# Altium schematic sheet Spannungsteiler_high.SchDoc
size A4; CompanyName: Technische Hochschule Nürnberg Georg Simon Ohm; Address1: Fürther Straße 250; Address2: 90429 Nürnberg; Address3: GERMANY; SheetNumber: 4; SheetTotal: 6; CompanyName2: Institut ELSYS
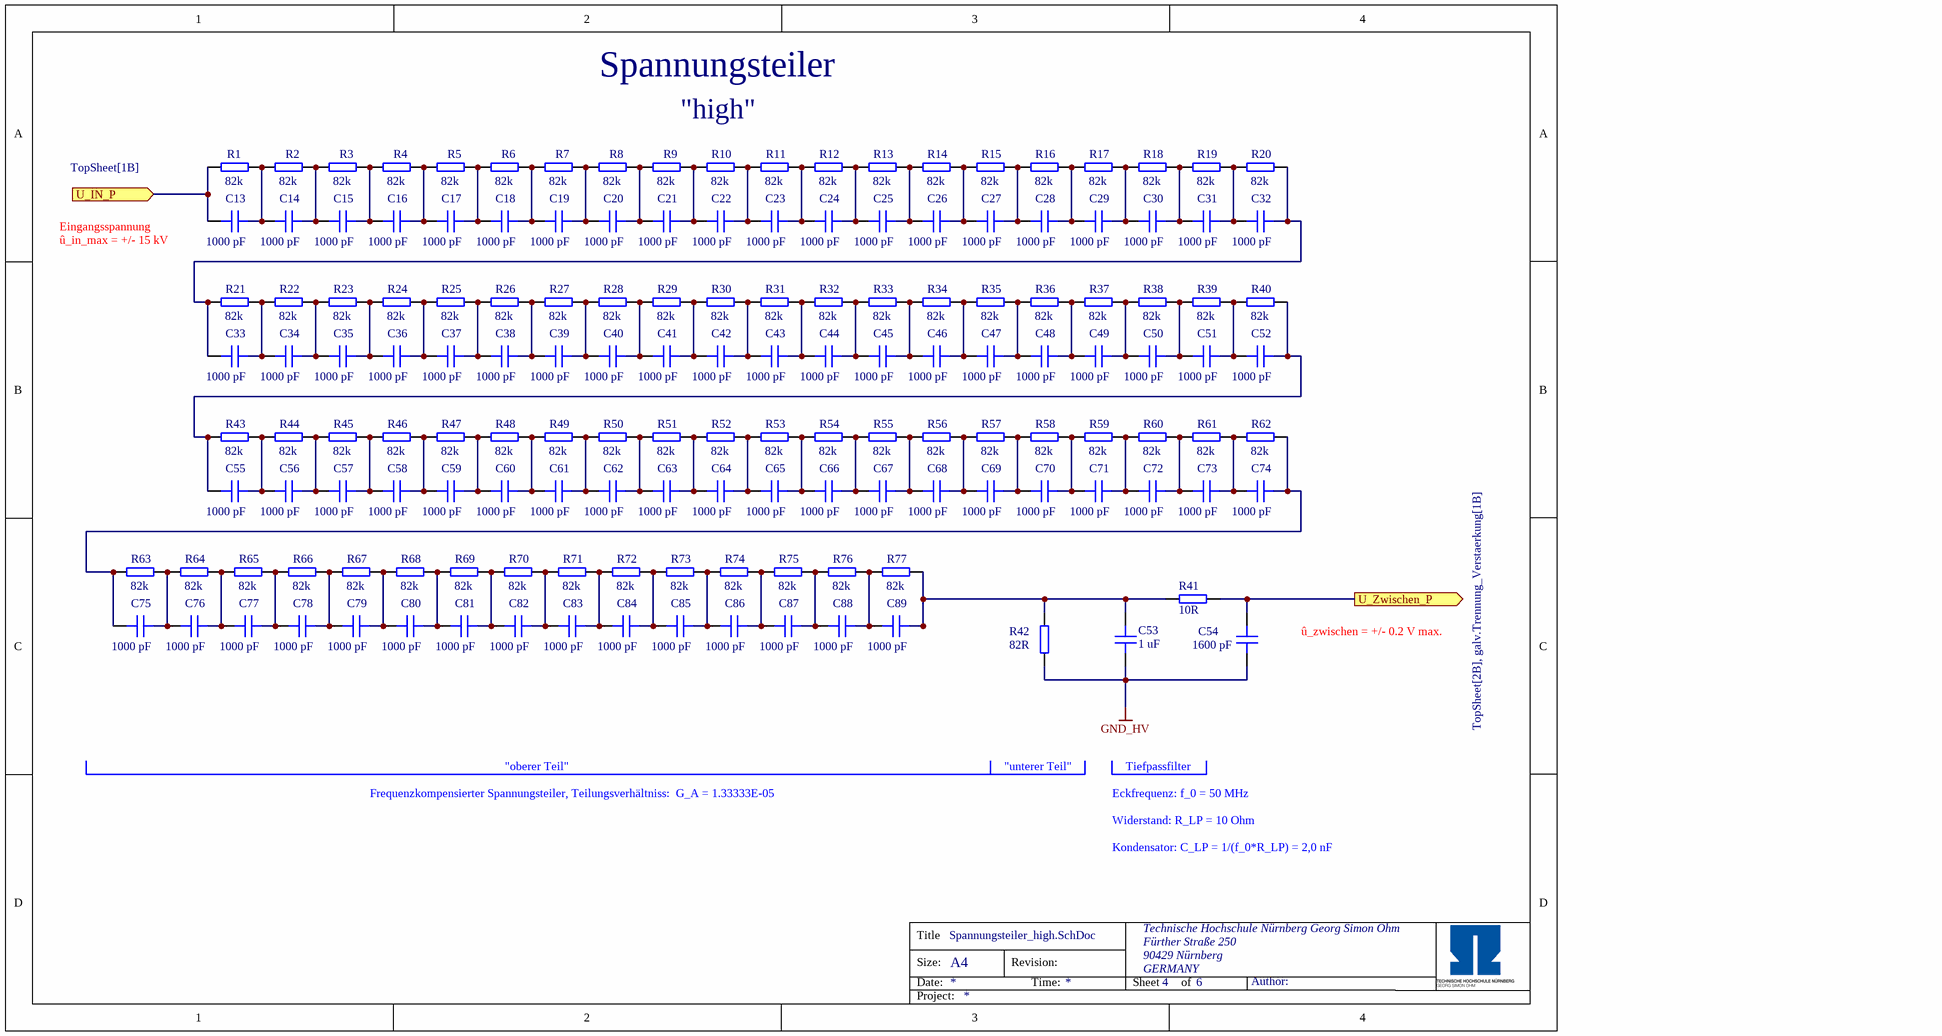
[diagram p0: Spannungsteiler_high.SchDoc]

## Parts
C13  1000 pF  [C_1206]
C14  1000 pF  [C_1206]
C15  1000 pF  [C_1206]
C16  1000 pF  [C_1206]
C17  1000 pF  [C_1206]
C18  1000 pF  [C_1206]
C19  1000 pF  [C_1206]
C20  1000 pF  [C_1206]
C21  1000 pF  [C_1206]
C22  1000 pF  [C_1206]
C23  1000 pF  [C_1206]
C24  1000 pF  [C_1206]
C25  1000 pF  [C_1206]
C26  1000 pF  [C_1206]
C27  1000 pF  [C_1206]
C28  1000 pF  [C_1206]
C29  1000 pF  [C_1206]
C30  1000 pF  [C_1206]
C31  1000 pF  [C_1206]
C32  1000 pF  [C_1206]
C33  1000 pF  [C_1206]
C34  1000 pF  [C_1206]
C35  1000 pF  [C_1206]
C36  1000 pF  [C_1206]
C37  1000 pF  [C_1206]
C38  1000 pF  [C_1206]
C39  1000 pF  [C_1206]
C40  1000 pF  [C_1206]
C41  1000 pF  [C_1206]
C42  1000 pF  [C_1206]
C43  1000 pF  [C_1206]
C44  1000 pF  [C_1206]
C45  1000 pF  [C_1206]
C46  1000 pF  [C_1206]
C47  1000 pF  [C_1206]
C48  1000 pF  [C_1206]
C49  1000 pF  [C_1206]
C50  1000 pF  [C_1206]
C51  1000 pF  [C_1206]
C52  1000 pF  [C_1206]
C53  1 uF  [C_1206]
C54  1600 pF  [C_1206]
C55  1000 pF  [C_1206]
C56  1000 pF  [C_1206]
C57  1000 pF  [C_1206]
C58  1000 pF  [C_1206]
C59  1000 pF  [C_1206]
C60  1000 pF  [C_1206]
C61  1000 pF  [C_1206]
C62  1000 pF  [C_1206]
C63  1000 pF  [C_1206]
C64  1000 pF  [C_1206]
C65  1000 pF  [C_1206]
C66  1000 pF  [C_1206]
C67  1000 pF  [C_1206]
C68  1000 pF  [C_1206]
C69  1000 pF  [C_1206]
C70  1000 pF  [C_1206]
C71  1000 pF  [C_1206]
C72  1000 pF  [C_1206]
C73  1000 pF  [C_1206]
C74  1000 pF  [C_1206]
C75  1000 pF  [C_1206]
C76  1000 pF  [C_1206]
C77  1000 pF  [C_1206]
C78  1000 pF  [C_1206]
C79  1000 pF  [C_1206]
C80  1000 pF  [C_1206]
C81  1000 pF  [C_1206]
C82  1000 pF  [C_1206]
C83  1000 pF  [C_1206]
C84  1000 pF  [C_1206]
C85  1000 pF  [C_1206]
C86  1000 pF  [C_1206]
C87  1000 pF  [C_1206]
C88  1000 pF  [C_1206]
C89  1000 pF  [C_1206]
R1  82k  [RES 1206_3216]
R2  82k  [RES 1206_3216]
R3  82k  [RES 1206_3216]
R4  82k  [RES 1206_3216]
R5  82k  [RES 1206_3216]
R6  82k  [RES 1206_3216]
R7  82k  [RES 1206_3216]
R8  82k  [RES 1206_3216]
R9  82k  [RES 1206_3216]
R10  82k  [RES 1206_3216]
R11  82k  [RES 1206_3216]
R12  82k  [RES 1206_3216]
R13  82k  [RES 1206_3216]
R14  82k  [RES 1206_3216]
R15  82k  [RES 1206_3216]
R16  82k  [RES 1206_3216]
R17  82k  [RES 1206_3216]
R18  82k  [RES 1206_3216]
R19  82k  [RES 1206_3216]
R20  82k  [RES 1206_3216]
R21  82k  [RES 1206_3216]
R22  82k  [RES 1206_3216]
R23  82k  [RES 1206_3216]
R24  82k  [RES 1206_3216]
R25  82k  [RES 1206_3216]
R26  82k  [RES 1206_3216]
R27  82k  [RES 1206_3216]
R28  82k  [RES 1206_3216]
R29  82k  [RES 1206_3216]
R30  82k  [RES 1206_3216]
R31  82k  [RES 1206_3216]
R32  82k  [RES 1206_3216]
R33  82k  [RES 1206_3216]
R34  82k  [RES 1206_3216]
R35  82k  [RES 1206_3216]
R36  82k  [RES 1206_3216]
R37  82k  [RES 1206_3216]
R38  82k  [RES 1206_3216]
R39  82k  [RES 1206_3216]
R40  82k  [RES 1206_3216]
R41  10R  [RES 0603_1608]
R42  82R  [RES 1206_3216]
R43  82k  [RES 1206_3216]
R44  82k  [RES 1206_3216]
R45  82k  [RES 1206_3216]
R46  82k  [RES 1206_3216]
R47  82k  [RES 1206_3216]
R48  82k  [RES 1206_3216]
R49  82k  [RES 1206_3216]
R50  82k  [RES 1206_3216]
R51  82k  [RES 1206_3216]
R52  82k  [RES 1206_3216]
R53  82k  [RES 1206_3216]
R54  82k  [RES 1206_3216]
R55  82k  [RES 1206_3216]
R56  82k  [RES 1206_3216]
R57  82k  [RES 1206_3216]
R58  82k  [RES 1206_3216]
R59  82k  [RES 1206_3216]
R60  82k  [RES 1206_3216]
R61  82k  [RES 1206_3216]
R62  82k  [RES 1206_3216]
R63  82k  [RES 1206_3216]
R64  82k  [RES 1206_3216]
R65  82k  [RES 1206_3216]
R66  82k  [RES 1206_3216]
R67  82k  [RES 1206_3216]
R68  82k  [RES 1206_3216]
R69  82k  [RES 1206_3216]
R70  82k  [RES 1206_3216]
R71  82k  [RES 1206_3216]
R72  82k  [RES 1206_3216]
R73  82k  [RES 1206_3216]
R74  82k  [RES 1206_3216]
R75  82k  [RES 1206_3216]
R76  82k  [RES 1206_3216]
R77  82k  [RES 1206_3216]

## Ports
U_IN_P (in, see TopSheet[1B]), U_Zwischen_P (out, see TopSheet[2B], galv.Trennung_Verstaerkung[1B])

## Nets
GND_HV: C53.1 C54.1 R42.1
U_IN_P: C13.1 R1.1 ; port U_IN_P
U_Zwischen_P: C54.2 R41.2 ; port U_Zwischen_P
NetC13_2: C13.2 C14.1 R1.2 R2.1
NetC14_2: C14.2 C15.1 R2.2 R3.1
NetC15_2: C15.2 C16.1 R3.2 R4.1
NetC16_2: C16.2 C17.1 R4.2 R5.1
NetC17_2: C17.2 C18.1 R5.2 R6.1
NetC18_2: C18.2 C19.1 R6.2 R7.1
NetC19_2: C19.2 C20.1 R7.2 R8.1
NetC20_2: C20.2 C21.1 R8.2 R9.1
NetC21_2: C21.2 C22.1 R9.2 R10.1
NetC22_2: C22.2 C23.1 R10.2 R11.1
NetC23_2: C23.2 C24.1 R11.2 R12.1
NetC24_2: C24.2 C25.1 R12.2 R13.1
NetC25_2: C25.2 C26.1 R13.2 R14.1
NetC26_2: C26.2 C27.1 R14.2 R15.1
NetC27_2: C27.2 C28.1 R15.2 R16.1
NetC28_2: C28.2 C29.1 R16.2 R17.1
NetC29_2: C29.2 C30.1 R17.2 R18.1
NetC30_2: C30.2 C31.1 R18.2 R19.1
NetC31_2: C31.2 C32.1 R19.2 R20.1
NetC32_2: C32.2 C33.1 R20.2 R21.1
NetC33_2: C33.2 C34.1 R21.2 R22.1
NetC34_2: C34.2 C35.1 R22.2 R23.1
NetC35_2: C35.2 C36.1 R23.2 R24.1
NetC36_2: C36.2 C37.1 R24.2 R25.1
NetC37_2: C37.2 C38.1 R25.2 R26.1
NetC38_2: C38.2 C39.1 R26.2 R27.1
NetC39_2: C39.2 C40.1 R27.2 R28.1
NetC40_2: C40.2 C41.1 R28.2 R29.1
NetC41_2: C41.2 C42.1 R29.2 R30.1
NetC42_2: C42.2 C43.1 R30.2 R31.1
NetC43_2: C43.2 C44.1 R31.2 R32.1
NetC44_2: C44.2 C45.1 R32.2 R33.1
NetC45_2: C45.2 C46.1 R33.2 R34.1
NetC46_2: C46.2 C47.1 R34.2 R35.1
NetC47_2: C47.2 C48.1 R35.2 R36.1
NetC48_2: C48.2 C49.1 R36.2 R37.1
NetC49_2: C49.2 C50.1 R37.2 R38.1
NetC50_2: C50.2 C51.1 R38.2 R39.1
NetC51_2: C51.2 C52.1 R39.2 R40.1
NetC52_2: C52.2 C55.1 R40.2 R43.1
NetC53_2: C53.2 C89.2 R41.1 R42.2 R77.2
NetC55_2: C55.2 C56.1 R43.2 R44.1
NetC56_2: C56.2 C57.1 R44.2 R45.1
NetC57_2: C57.2 C58.1 R45.2 R46.1
NetC58_2: C58.2 C59.1 R46.2 R47.1
NetC59_2: C59.2 C60.1 R47.2 R48.1
NetC60_2: C60.2 C61.1 R48.2 R49.1
NetC61_2: C61.2 C62.1 R49.2 R50.1
NetC62_2: C62.2 C63.1 R50.2 R51.1
NetC63_2: C63.2 C64.1 R51.2 R52.1
NetC64_2: C64.2 C65.1 R52.2 R53.1
NetC65_2: C65.2 C66.1 R53.2 R54.1
NetC66_2: C66.2 C67.1 R54.2 R55.1
NetC67_2: C67.2 C68.1 R55.2 R56.1
NetC68_2: C68.2 C69.1 R56.2 R57.1
NetC69_2: C69.2 C70.1 R57.2 R58.1
NetC70_2: C70.2 C71.1 R58.2 R59.1
NetC71_2: C71.2 C72.1 R59.2 R60.1
NetC72_2: C72.2 C73.1 R60.2 R61.1
NetC73_2: C73.2 C74.1 R61.2 R62.1
NetC74_2: C74.2 C75.1 R62.2 R63.1
NetC75_2: C75.2 C76.1 R63.2 R64.1
NetC76_2: C76.2 C77.1 R64.2 R65.1
NetC77_2: C77.2 C78.1 R65.2 R66.1
NetC78_2: C78.2 C79.1 R66.2 R67.1
NetC79_2: C79.2 C80.1 R67.2 R68.1
NetC80_2: C80.2 C81.1 R68.2 R69.1
NetC81_2: C81.2 C82.1 R69.2 R70.1
NetC82_2: C82.2 C83.1 R70.2 R71.1
NetC83_2: C83.2 C84.1 R71.2 R72.1
NetC84_2: C84.2 C85.1 R72.2 R73.1
NetC85_2: C85.2 C86.1 R73.2 R74.1
NetC86_2: C86.2 C87.1 R74.2 R75.1
NetC87_2: C87.2 C88.1 R75.2 R76.1
NetC88_2: C88.2 C89.1 R76.2 R77.1

## Notes on the sheet
- Spannungsteiler
- "high"
- Eingangsspannung
- û_in_max = +/- 15 kV
- û_zwischen = +/- 0.2 V max.
- "oberer Teil"
- "unterer Teil"
- Tiefpassfilter
- Frequenzkompensierter Spannungsteiler, Teilungsverhältniss:  G_A = 1.33333E-05
- Eckfrequenz: f_0 = 50 MHz
- Widerstand: R_LP = 10 Ohm
- Kondensator: C_LP = 1/(f_0*R_LP) = 2,0 nF
- Title
- Size:
- Date:
- A4
- Revision:
- Time:
- Sheet
- of
- Author:
- Project:

## Library data of the parts
C13-C52 C55-C89 = C1206C102J2GACTU: Capacitor 1206, 200VDC, 1000pF, C0G, 5%; Manufacturer: KEMET; Created from: TGaupp; Supplier 1: Mouser; Supplier Part Number 1: 80-C1206C102J2G; Value: 1000 pF; Manufacturer Part Number: C1206C102J2GACTU; PartID: 135; Created On: 08.08.2023 10:37:32; ComponentLink1Description: Datasheet; ComponentLink1URL: https://www.mouser.de/datasheet/2/212/KEM_C1003_C0G_SMD-1101588.pdf; Component Type: Capacitor 1206; Device Package: 1206; Last Updated: 08.08.2023 10:37:39; Mounting Type: SMD; Operating Temperature: -55 - 125°C; Series: SMD Comm C0G; Type: Capacitor; Tolerance: 5 %; Voltage Rating: 200 VDC; Live Cycle Status: 1; LCSC Part Number: C2167363; Stock number: not stored
C53 = C1206X105J5RACTU: Capacitor 1206, 50V, 1uF, X7R, 5%; Manufacturer: KEMET; Voltage Rating: 50 VDC; Created from: TGaupp; Manufacturer Part Number: C1206X105J5RACTU; PartID: 137; Created On: 28.08.2023 09:04:24; ComponentLink1Description: Datasheet; ComponentLink1URL: https://www.mouser.de/datasheet/2/212/1/KEM_C1013_X7R_FT_CAP_SMD-1103280.pdf; Component Type: Capacitor 1206; Device Package: 1206; Last Updated: 28.08.2023 09:04:24; Mounting Type: SMD; Operating Temperature: -55 - 125°C; Series: SMD Comm X7R Flex; Supplier 1: Mouser; Supplier Part Number 1: 80-C1206X105J5RACTU; Type: Capacitor; Tolerance: 5 %; Value: 1 uF; Live Cycle Status: 1; Stock number: not stored
C54 = C1206C162K3HACTU: Capacitor 1206, 25V, 1600pF, X8R, 10%; Manufacturer: KEMET; Tolerance: 12 %; Voltage Rating: 25 VDC; Created from: TGaupp; Supplier 1: Mouser; Supplier Part Number 1: 80-C1206C162K3HACTU; Value: 1600 pF; Manufacturer Part Number: C1206C162K3HACTU; PartID: 136; Created On: 08.08.2023 12:37:56; ComponentLink1Description: Datasheet; ComponentLink1URL: https://www.mouser.de/datasheet/2/212/KEM_C1007_X8R_ULTRA_150C_SMD-1102703.pdf; Component Type: Capacitor 1206; Device Package: 1206; Last Updated: 08.08.2023 12:37:56; Mounting Type: SMD; Operating Temperature: -55 - 125°C; Series: SMD Comm X8R HT150C; Type: Capacitor; Live Cycle Status: 1; Stock number: not stored
R1-R40 R43-R77 = TNPW120682K0BEEA: SMD resistor 82Kohms .1% 25ppm; Manufacturer: Vishay; Tolerance: 0.1%; Created from: TGaupp; Supplier 1: Mouser; Supplier Part Number 1: 71-TNPW120682K0BEEA; Value: 82k; Manufacturer Part Number: TNPW120682K0BEEA; PartID: 290; Created On: 08.08.2023 09:29:01; ComponentLink1Description: Datasheet; ComponentLink1URL: https://www.vishay.com/docs/28758/tnpw_e3.pdf; Component Type: SMD resistor; Device Package: 1206; Last Updated: 08.08.2023 09:29:01; Mounting Type: SMD; Type: Resistor; Live Cycle Status: 1; Stock number: not stored; LCSC Part Number: C2089369
R41 = CRCW060310R0FKTA: SMD 1/10watt 10ohms 1%; Manufacturer: Vishay; Created from: TGaupp; Manufacturer Part Number: CRCW060310R0FKTA; PartID: 296; Created On: 28.08.2023 12:16:52; ComponentLink1Description: Datasheet; ComponentLink1URL: https://www.vishay.com/docs/20008/dcrcw.pdf; Component Type: SMD resistor; Device Package: 0603; Last Updated: 28.08.2023 12:16:52; Mounting Type: SMD; Supplier 1: Mouser; Supplier Part Number 1: 71-CRCW0603-10; Type: Resistor; Tolerance: 1 %; Value: 10R; Live Cycle Status: 1; Stock number: not stored; LCSC Part Number: C2091419
R42 = RT1206BRD0782RL: SMD resistor 1/4W 82 ohm .1% 25ppm; Manufacturer: YAGEO; Tolerance: 0.1%; Created from: TGaupp; Supplier 1: Mouser; Supplier Part Number 1: 603-RT1206BRD0782RL; Value: 82R; Manufacturer Part Number: RT1206BRD0782RL; PartID: 291; Created On: 08.08.2023 10:07:21; ComponentLink1Description: Datasheet; ComponentLink1URL: https://www.mouser.de/datasheet/2/447/PYu_RT_1_to_0_01_RoHS_L_12-3003070.pdf; Component Type: SMD resistor; Device Package: 1206; Last Updated: 08.08.2023 10:07:21; Mounting Type: SMD; Type: Resistor; Live Cycle Status: 1; Stock number: not stored; LCSC Part Number: C870908